# Altium project RPI GPIO BOARD.PrjPcb
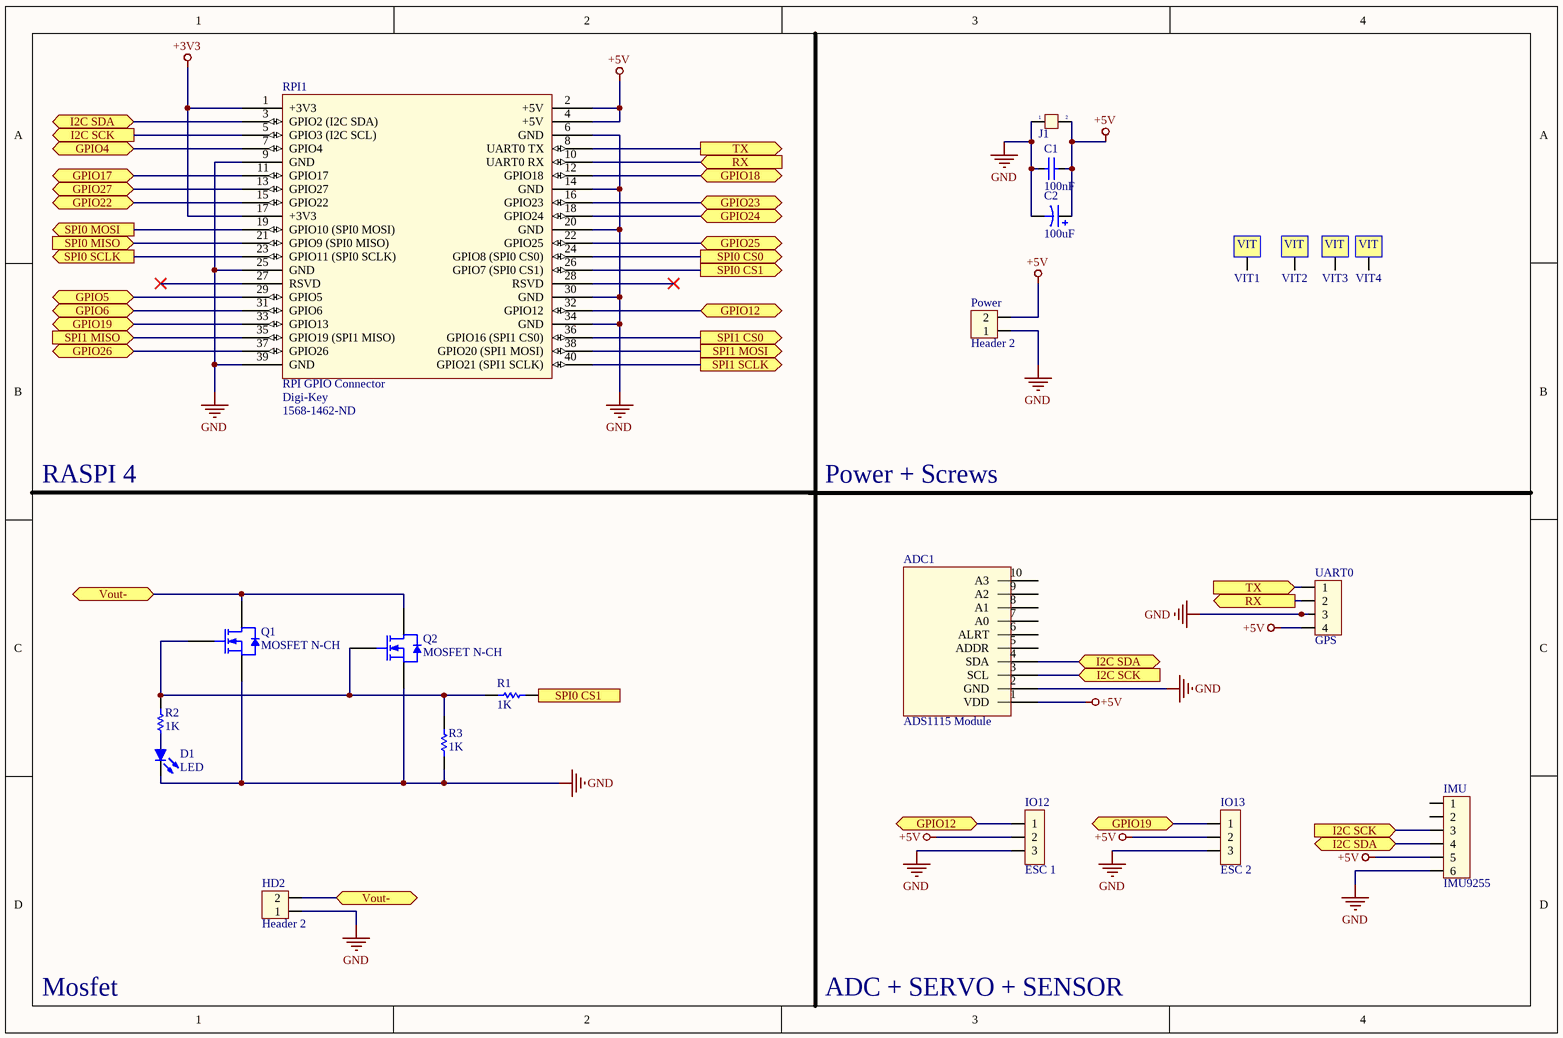
[diagram p0: RPI.SchDoc]
mProjectAuthor: Nils Minor; mProjectName: RPI BOARD; mProjectRevision: 0; mProjectVersion: 1
1 sheet, 21 parts. Net scope: flat (ports and power ports of the same name join across sheets).
Board file: RPI.PcbDoc

## Sheet RPI.SchDoc
size A4; SheetNumber: 1; SheetTotal: 1

### Parts
ADC1  ADS1115 Module  [ADS1115]
C1  100nF  [C 0805]
C2  100uF  [CAP ELECTROLIT SMD 4*5.4]
D1  LED  [L0805]
HD2  Header 2  [HED2T]
IMU  IMU9255  [HDR1X6H]
IO12  ESC 1  [JP3]
IO13  ESC 2  [JP3]
J1  Jumper 2  [JP2]  (value not drawn)
Power  Header 2  [HED2]
Q1  MOSFET N-CH  [D-PACK]
Q2  MOSFET N-CH  [D-PACK]
R1  1K  [RES 0805]
R2  1K  [RES 0805]
R3  1K  [RES 0805]
RPI1  RPI GPIO Connector  Supplier 1: Digi-Key  Supplier Part Number 1: 1568-1462-ND  [rpi]
UART0  GPS  [CON4]
VIT1  VIT  [VIT]  (value not drawn)
VIT2  VIT  [VIT]  (value not drawn)
VIT3  VIT  [VIT]  (value not drawn)
VIT4  VIT  [VIT]  (value not drawn)

### Ports
GPIO4 (bidir), GPIO5 (bidir), GPIO6 (bidir), GPIO12 (bidir), GPIO17 (bidir), GPIO18 (bidir), GPIO19 (bidir), GPIO22 (bidir), GPIO23 (bidir), GPIO24 (bidir), GPIO25 (bidir), GPIO26 (bidir), GPIO27 (bidir), I2C SCK (in), I2C SCK (out), I2C SDA (bidir), RX (in), RX (out), SPI0 CS0 (out), SPI0 CS1 (in), SPI0 CS1 (out), SPI0 MISO (in), SPI0 MOSI (out), SPI0 SCLK (out), SPI1 CS0 (out), SPI1 MISO (in), SPI1 MOSI (out), SPI1 SCLK (out), TX (in), TX (out), Vout- (bidir)

### Nets
+3V3: RPI1.1(+3V3) RPI1.17(+3V3)
+5V: ADC1.1(VDD) C1.1 C2.1 IMU.5 IO12.2 IO13.2 J1.2 Power.2 RPI1.2(+5V) RPI1.4(+5V) UART0.4
GND: ADC1.2(GND) C1.2 C2.2 D1.K HD2.1 IMU.6 IO12.3 IO13.3 J1.1 Power.1 Q1.3(S) Q2.3(S) R3.1 RPI1.6(GND) RPI1.9(GND) RPI1.14(GND) RPI1.20(GND) RPI1.25(GND) RPI1.30(GND) RPI1.34(GND) RPI1.39(GND) UART0.3
NetADC1_3: ADC1.3(SCL) IMU.3 RPI1.5(GPIO3_(I2C_SCL)) ; port I2C SCK
NetADC1_4: ADC1.4(SDA) IMU.4 RPI1.3(GPIO2_(I2C_SDA)) ; port I2C SDA
NetD1_A: D1.A R2.1
NetHD2_2: HD2.2 Q1.2(D) Q2.2(D) ; port Vout-
NetIO12_1: IO12.1 RPI1.32(GPIO12) ; port GPIO12
NetIO13_1: IO13.1 RPI1.33(GPIO13) ; port GPIO19
NetQ1_1: Q1.1(G) Q2.1(G) R1.1 R2.2 R3.2
NetR1_2: R1.2 RPI1.26(GPIO7_(SPI0_CS1)) ; port SPI0 CS1
NetRPI1_7: RPI1.7(GPIO4) ; port GPIO4
NetRPI1_8: RPI1.8(UART0_TX) UART0.1 ; port TX
NetRPI1_10: RPI1.10(UART0_RX) UART0.2 ; port RX
NetRPI1_11: RPI1.11(GPIO17) ; port GPIO17
NetRPI1_12: RPI1.12(GPIO18) ; port GPIO18
NetRPI1_13: RPI1.13(GPIO27) ; port GPIO27
NetRPI1_15: RPI1.15(GPIO22) ; port GPIO22
NetRPI1_16: RPI1.16(GPIO23) ; port GPIO23
NetRPI1_18: RPI1.18(GPIO24) ; port GPIO24
NetRPI1_19: RPI1.19(GPIO10_(SPI0_MOSI)) ; port SPI0 MOSI
NetRPI1_21: RPI1.21(GPIO9_(SPI0_MISO)) ; port SPI0 MISO
NetRPI1_22: RPI1.22(GPIO25) ; port GPIO25
NetRPI1_23: RPI1.23(GPIO11_(SPI0_SCLK)) ; port SPI0 SCLK
NetRPI1_24: RPI1.24(GPIO8_(SPI0_CS0)) ; port SPI0 CS0
NetRPI1_29: RPI1.29(GPIO5) ; port GPIO5
NetRPI1_31: RPI1.31(GPIO6) ; port GPIO6
NetRPI1_35: RPI1.35(GPIO19_(SPI1_MISO)) ; port SPI1 MISO
NetRPI1_36: RPI1.36(GPIO16_(SPI1_CS0)) ; port SPI1 CS0
NetRPI1_37: RPI1.37(GPIO26) ; port GPIO26
NetRPI1_38: RPI1.38(GPIO20_(SPI1_MOSI)) ; port SPI1 MOSI
NetRPI1_40: RPI1.40(GPIO21_(SPI1_SCLK)) ; port SPI1 SCLK

Not connected (* = marked no-connect by the designer): ADC1 5(ADDR) 6(ALRT) 7(A0) 8(A1) 9(A2) 10(A3); IMU 1 2; RPI1 27(RSVD)* 28(RSVD)*; VIT1 VIT1(1); VIT2 VIT1(1); VIT3 VIT1(1); VIT4 VIT1(1)

### Notes on the sheet
- RASPI 4
- Power + Screws
- Mosfet
- ADC + SERVO + SENSOR

### Library data of the parts
ADC1 = ADS1115 Module ADC
C1 = CAP CERAIC: Capacitor; Degigned by: Mehdi Meghdadi; Publisher: iDr.; WEB SITE: www.idrdot.ir
C2 = CAP ELECTROLIT SMD: Capacitor
HD2 Power = Hed2: Header 2 (Green); Value: Header 2
IMU = jam 6: Value: Connector 6
IO12 IO13 = JP3: Jumper 3; Value: J3
J1 = JP 2: Value: JP 2
Q1 Q2 = MOSFET N-CH: TRANSISTOR MOSFET N-CH
R1-R3 = RES: RESISTOR
RPI1 = rpi connector: GPIO Header for Raspberry Pi A+/B+/Pi 2/Pi 3 - 2x20; Manufacturer: SparkFun Electronics; Manufacturer Part Number: PRT-14017; Nils Minor: author; nilsminor@web.de: mail; RoHS: RoHS Compliant; Category: Development Boards, Kits, Programmers; Stock 1: 150; Pricing 1: 1=1.84 (EUR); Part Status: Active; Accessory Type: Connector; For Use With/Related Products: Raspberry Pi; ComponentLink1URL: https://cdn.sparkfun.com/datasheets/Dev/RaspberryPi/12313.pdf; ComponentLink1Description: https://cdn.sparkfun.com/datasheets/Dev/RaspberryPi/12313.pdf
UART0 = Con4: Connector 4; Value: Connector 4
VIT1-VIT4 = VIT: Oc Vit

## Assembly variants
default: all parts fitted